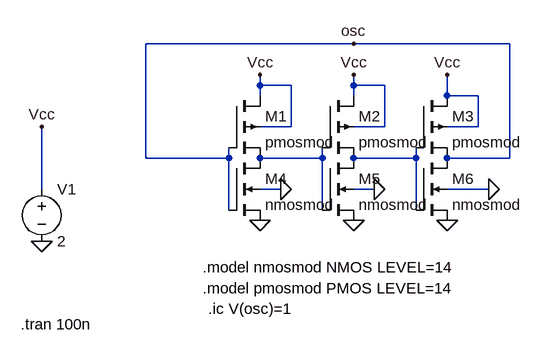
[diagram p0: schematic Ring oscillator.asc]
Ring oscillator.asc, the LTspice schematic file:
Version 4.1
SHEET 1 880 680
WIRE 448 -80 128 -80
WIRE 688 -80 448 -80
WIRE 304 -16 304 -32
WIRE 352 -16 304 -16
WIRE 448 -16 448 -32
WIRE 496 -16 448 -16
WIRE 304 0 304 -16
WIRE 448 0 448 -16
WIRE 592 0 592 -32
WIRE 640 0 592 0
WIRE 352 48 352 -16
WIRE 352 48 304 48
WIRE 496 48 496 -16
WIRE 496 48 448 48
WIRE 640 48 640 0
WIRE 640 48 592 48
WIRE 128 96 128 -80
WIRE 256 96 256 80
WIRE 256 96 128 96
WIRE 400 96 400 80
WIRE 400 96 304 96
WIRE 544 96 544 80
WIRE 544 96 448 96
WIRE 688 96 688 -80
WIRE 688 96 592 96
WIRE -32 144 -32 48
WIRE 336 144 304 144
WIRE 480 144 448 144
WIRE 656 144 592 144
WIRE 256 176 256 96
WIRE 400 176 400 96
WIRE 544 176 544 96
FLAG -32 224 0
FLAG -32 48 Vcc
FLAG 304 192 0
FLAG 448 192 0
FLAG 592 192 0
FLAG 448 -80 osc
FLAG 336 144 0
FLAG 480 144 0
FLAG 656 144 0
FLAG 304 -32 Vcc
FLAG 448 -32 Vcc
FLAG 592 -32 Vcc
SYMBOL voltage -32 128 R0
WINDOW 123 0 0 Left 0
WINDOW 39 0 0 Left 0
SYMATTR InstName V1
SYMATTR Value 2
SYMBOL pmos4 256 0 R0
SYMATTR InstName M1
SYMATTR Value pmosmod
SYMBOL pmos4 400 0 R0
SYMATTR InstName M2
SYMATTR Value pmosmod
SYMBOL pmos4 544 0 R0
SYMATTR InstName M3
SYMATTR Value pmosmod
SYMBOL nmos4 256 96 R0
SYMATTR InstName M4
SYMATTR Value nmosmod
SYMBOL nmos4 400 96 R0
SYMATTR InstName M5
SYMATTR Value nmosmod
SYMBOL nmos4 544 96 R0
SYMATTR InstName M6
SYMATTR Value nmosmod
TEXT 216 264 Left 2 !.model nmosmod NMOS LEVEL=14
TEXT 216 296 Left 2 !.model pmosmod PMOS LEVEL=14
TEXT 224 328 Left 2 !.ic V(osc)=1
TEXT -64 352 Left 2 !.tran 100n

The netlist it stands for:
* Ring oscillator.asc
V1 Vcc 0 2
M1 Vcc osc N001 Vcc pmosmod
M2 Vcc N001 N002 Vcc pmosmod
M3 Vcc N002 osc Vcc pmosmod
M4 N001 osc 0 0 nmosmod
M5 N002 N001 0 0 nmosmod
M6 osc N002 0 0 nmosmod
.model NMOS NMOS
.model PMOS PMOS
.lib standard.mos
.model nmosmod NMOS LEVEL=14
.model pmosmod PMOS LEVEL=14
.ic V(osc)=1
.tran 100n
.backanno
.end